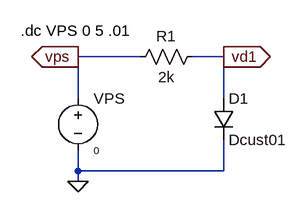
[diagram p0: schematic exam1_10_Dcust01.asc]
exam1_10_Dcust01.asc, the LTspice schematic file:
Version 4
SHEET 1 880 680
WIRE 192 80 96 80
WIRE 320 80 272 80
WIRE 96 144 96 80
WIRE 320 144 320 80
WIRE 96 256 96 224
WIRE 320 256 320 208
WIRE 320 256 96 256
WIRE 96 272 96 256
FLAG 96 272 0
FLAG 320 80 vd1
IOPIN 320 80 Out
FLAG 96 80 vps
IOPIN 96 80 Out
SYMBOL voltage 96 128 R0
WINDOW 3 24 96 Left 1
SYMATTR InstName VPS
SYMATTR Value 0
SYMBOL res 288 64 R90
WINDOW 0 0 56 VBottom 2
WINDOW 3 32 56 VTop 2
SYMATTR InstName R1
SYMATTR Value 2k
SYMBOL diode 304 144 R0
SYMATTR InstName D1
SYMATTR Value Dcust01
TEXT 8 40 Left 2 !.dc VPS 0 5 .01

The netlist it stands for:
* exam1_10_Dcust01.asc
VPS vps 0 0
R1 vd1 vps 2k
D1 vd1 0 Dcust01
.model D D
.lib standard.dio
.dc VPS 0 5 .01
.backanno
.end

* Results of the author's LTspice run, read from the files saved beside the schematic
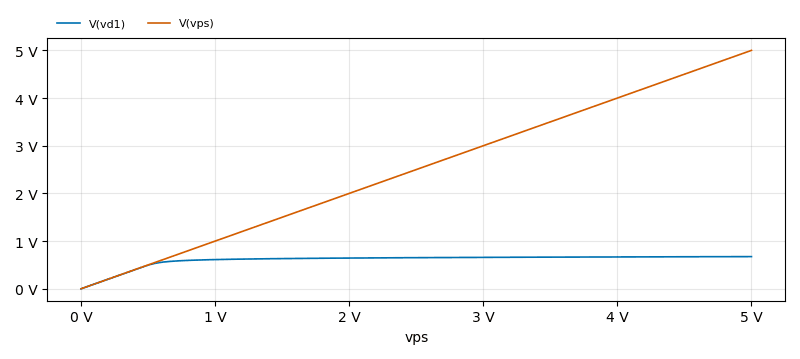
[diagram p1: DC transfer characteristic of exam1_10_Dcust01.asc, plotted from the saved traces]
* DC transfer characteristic, 1 run:
*   V(vd1): 0 V at vps=0 V, 675.1 mV at vps=5 V, min 0 V, max 675.1 mV
*   V(vps): 0 V at vps=0 V, 5 V at vps=5 V, min 0 V, max 5 V